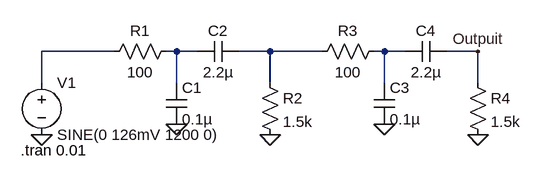
[diagram p0: schematic Filter.asc]
Filter.asc, the LTspice schematic file:
Version 4
SHEET 1 880 680
WIRE 96 64 -16 64
WIRE 192 64 176 64
WIRE 224 64 192 64
WIRE 336 64 288 64
WIRE 416 64 336 64
WIRE 512 64 496 64
WIRE 544 64 512 64
WIRE 656 64 608 64
WIRE -16 112 -16 64
WIRE 192 112 192 64
WIRE 336 112 336 64
WIRE 512 112 512 64
WIRE 656 112 656 64
FLAG -16 192 0
FLAG 192 176 0
FLAG 336 192 0
FLAG 512 176 0
FLAG 656 192 0
FLAG 656 64 Outpuit
SYMBOL voltage -16 96 R0
WINDOW 123 0 0 Left 0
WINDOW 39 0 0 Left 0
SYMATTR InstName V1
SYMATTR Value SINE(0 126mV 1200 0)
SYMBOL res 192 48 R90
WINDOW 0 0 56 VBottom 2
WINDOW 3 32 56 VTop 2
SYMATTR InstName R1
SYMATTR Value 100
SYMBOL cap 176 112 R0
SYMATTR InstName C1
SYMATTR Value 0.1µ
SYMBOL cap 288 48 R90
WINDOW 0 0 32 VBottom 2
WINDOW 3 32 32 VTop 2
SYMATTR InstName C2
SYMATTR Value 2.2µ
SYMBOL res 320 96 R0
SYMATTR InstName R2
SYMATTR Value 1.5k
SYMBOL res 512 48 R90
WINDOW 0 0 56 VBottom 2
WINDOW 3 32 56 VTop 2
SYMATTR InstName R3
SYMATTR Value 100
SYMBOL cap 496 112 R0
SYMATTR InstName C3
SYMATTR Value 0.1µ
SYMBOL cap 608 48 R90
WINDOW 0 0 32 VBottom 2
WINDOW 3 32 32 VTop 2
SYMATTR InstName C4
SYMATTR Value 2.2µ
SYMBOL res 640 96 R0
SYMATTR InstName R4
SYMATTR Value 1.5k
TEXT -48 216 Left 2 !.tran 0.01

The netlist it stands for:
* Filter.asc
V1 N001 0 SINE(0 126mV 1200 0)
R1 N002 N001 100
C1 N002 0 0.1µ
C2 N003 N002 2.2µ
R2 N003 0 1.5k
R3 N004 N003 100
C3 N004 0 0.1µ
C4 Outpuit N004 2.2µ
R4 Outpuit 0 1.5k
.tran 0.01
.backanno
.end